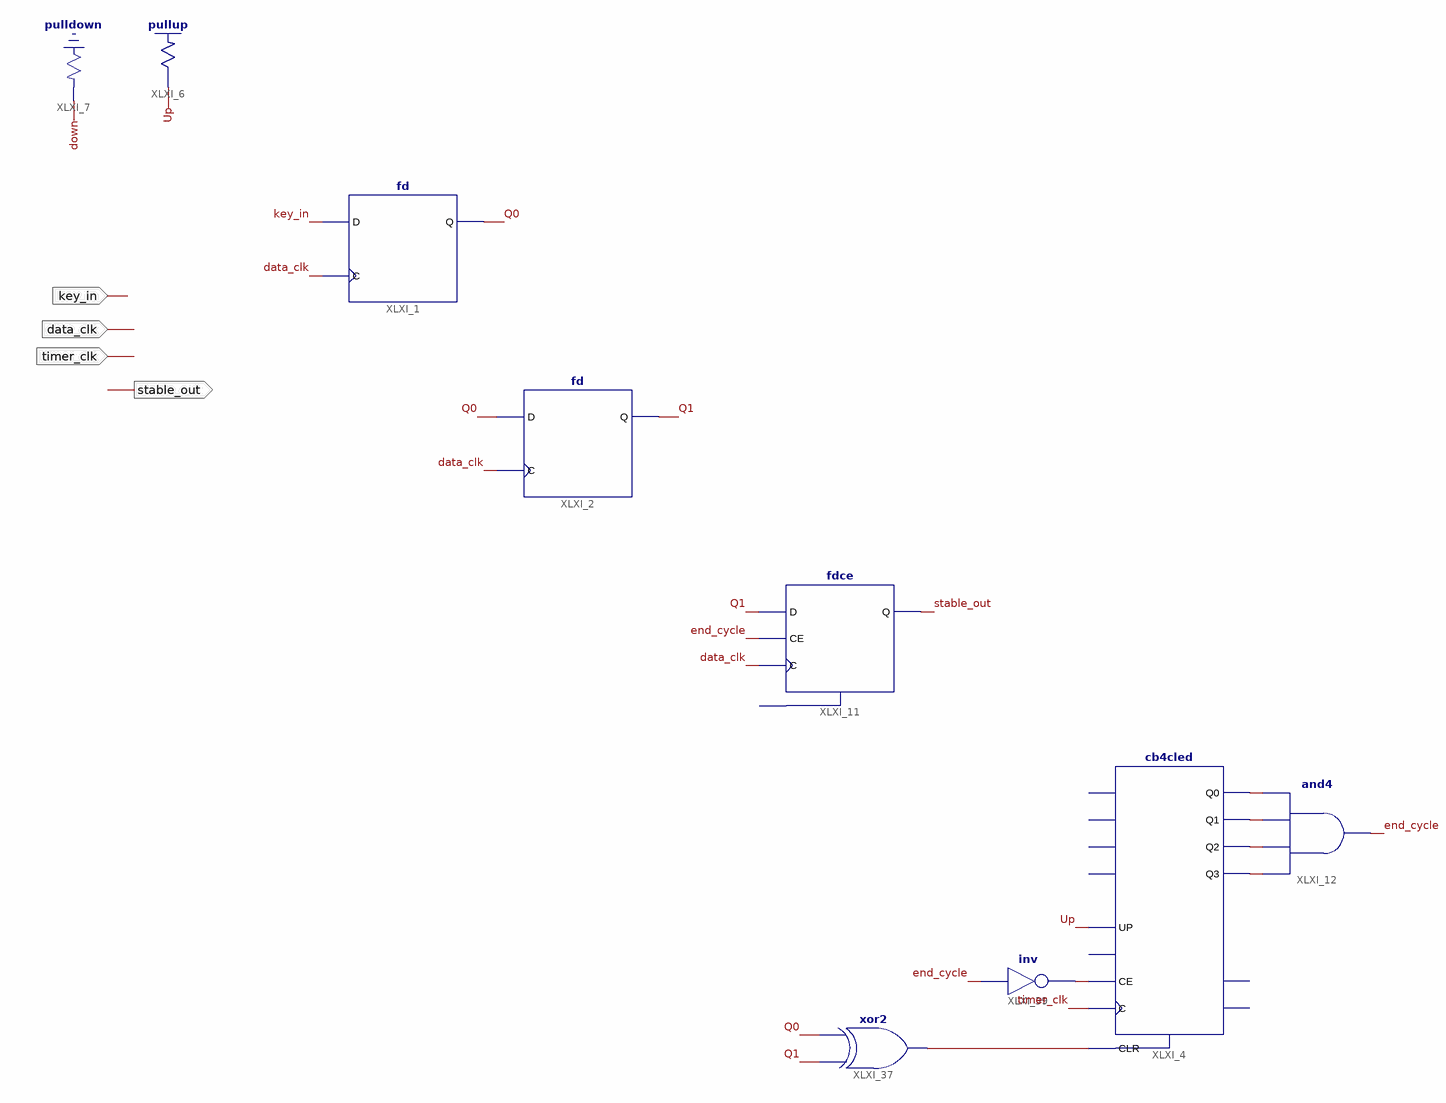
[diagram p0: schematic sheet 1]
// Xilinx ISE schematic Debounce.sch (spartan3e) as structural Verilog: 9 symbols, 4 ports
module Debounce (
  input  data_clk,
  input  key_in,
  input  timer_clk,
  output stable_out
);

  wire down, end_cycle, Q0, Q1, Up, XLXN_31, XLXN_32, XLXN_33, XLXN_34, XLXN_132, XLXN_136;

  \pulldown  XLXI_7 (.O(down));
  \pullup  XLXI_6 (.O(Up));
  fd XLXI_2 (.C(data_clk), .D(Q0), .Q(Q1));
  fd XLXI_1 (.C(data_clk), .D(key_in), .Q(Q0));
  fdce XLXI_11 (.C(data_clk), .CE(end_cycle), .D(Q1), .Q(stable_out));  // open: CLR
  cb4cled XLXI_4 (
    .C(timer_clk), .CE(XLXN_136), .CLR(XLXN_132), .UP(Up), .Q0(XLXN_34), .Q1(XLXN_33), .Q2(XLXN_32),
    .Q3(XLXN_31));  // open: D0, D1, D2, D3, L, CEO, TC
  and XLXI_12 (end_cycle, XLXN_31, XLXN_32, XLXN_33, XLXN_34);
  xor XLXI_37 (XLXN_132, Q1, Q0);
  not XLXI_39 (XLXN_136, end_cycle);
endmodule
